# EAGLE design stepstick (EAGLE 5.11)
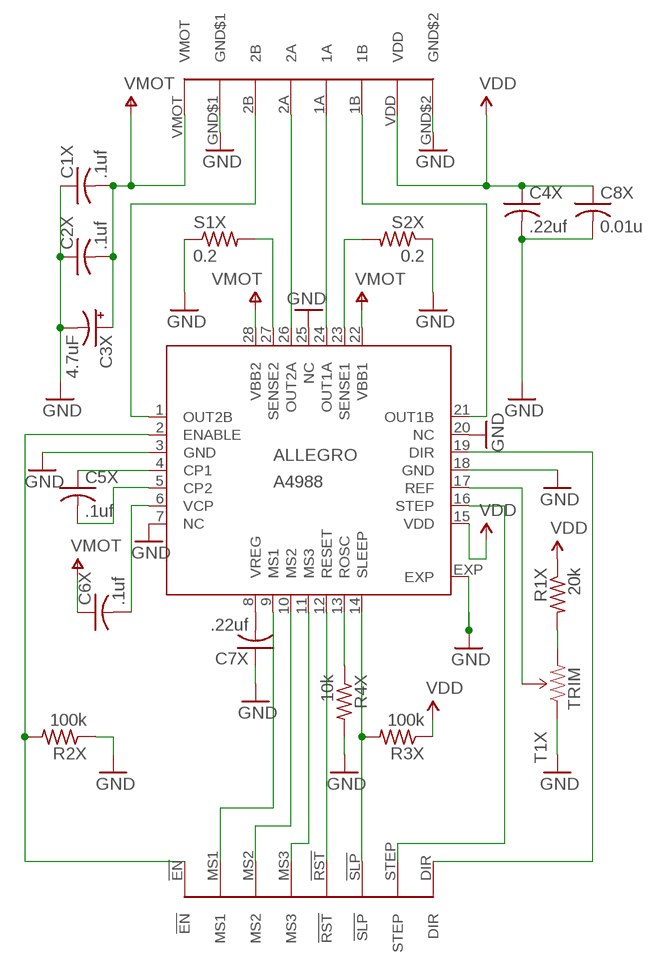
[diagram p0: schematic, sheet 1]

## Parts
ALLEGRO  A4988  A4983  [QFN28ET]
C1X  .1uf  C-USC0402  [C0402]
C2X  .1uf  C-USC0402  [C0402]
C3X  4.7uF  CPOL-USCT3216  [CT3216]
C4X  .22uf  C-USC0603  [C0603]
C5X  .1uf  C-USC0402  [C0402]
C6X  .1uf  C-USC0402  [C0402]
C7X  .22uf  C-USC0402  [C0402]
C8X  0.01u  C-USC0402  [C0402]
J1X  CLONOLU  [CLONOLU]
R1X  20k  R-US_R0402  [R0402]
R2X  100k  R-US_R0402  [R0402]
R3X  100k  R-US_R0402  [R0402]
R4X  10k  R-US_R0402  [R0402]
S1X  0.2  R-US_R0805  [R0805]
S2X  0.2  R-US_R0805  [R0805]
T1X  TRIM  TRIMPOTSMD  [TRIMPOT-3MM]

## Nets
GND: ALLEGRO.3(GND) ALLEGRO.7(NC) ALLEGRO.18(GND) ALLEGRO.20(NC) ALLEGRO.25(NC) ALLEGRO.EXP C1X.1 C2X.1 C3X.- C4X.2 C7X.1 C8X.2 J1X.GND$1(A4983$2:GND$1) J1X.GND$2(A4983$2:GND$2) R2X.1 R4X.2 S1X.1 S2X.1 T1X.1(CCW)
VDD: ALLEGRO.15(VDD) C4X.1 C8X.1 J1X.VDD(A4983$2:VDD) R1X.1 R3X.1
VMOT: ALLEGRO.22(VBB1) ALLEGRO.28(VBB2) C1X.2 C2X.2 C3X.+ C6X.1 J1X.VMOT(A4983$2:VMOT)
XCP1: ALLEGRO.4(CP1) C5X.1
XCP2: ALLEGRO.5(CP2) C5X.2
XDIR: ALLEGRO.19(DIR) J1X.DIR(A4983$1:DIR)
XENABLE: ALLEGRO.2(ENABLE) J1X.!EN(A4983$1:!EN) R2X.2
XMS1: ALLEGRO.9(MS1) J1X.MS1(A4983$1:MS1)
XMS2: ALLEGRO.10(MS2) J1X.MS2(A4983$1:MS2)
XMS3: ALLEGRO.11(MS3) J1X.MS3(A4983$1:MS3)
XOUT1A: ALLEGRO.24(OUT1A) J1X.1A(A4983$2:1A)
XOUT1B: ALLEGRO.21(OUT1B) J1X.1B(A4983$2:1B)
XOUT2A: ALLEGRO.26(OUT2A) J1X.2A(A4983$2:2A)
XOUT2B: ALLEGRO.1(OUT2B) J1X.2B(A4983$2:2B)
XREF: ALLEGRO.17(REF) T1X.2(WIPER)
XREF2: R1X.2 T1X.3(CW)
XRESET: ALLEGRO.12(RESET) J1X.!RST(A4983$1:!RST)
XROSC: ALLEGRO.13(ROSC) R4X.1
XSENSE1: ALLEGRO.23(SENSE1) S2X.2
XSENSE2: ALLEGRO.27(SENSE2) S1X.2
XSLEEP: ALLEGRO.14(SLEEP) J1X.!SLP(A4983$1:!SLP) R3X.2
XSTEP: ALLEGRO.16(STEP) J1X.STEP(A4983$1:STEP)
XVCP: ALLEGRO.6(VCP) C6X.2
XVREG: ALLEGRO.8(VREG) C7X.2

## Library data of the parts
ALLEGRO = allegro:A4983: DMOS Microstepping Driver with Translator Auto generated by make-symbol-device-package-bsdl.ulp Rev. 32 Source: http://www.allegromicro.com/en/Products/Part_Numbers/4983/4983.pdf; MPN: A4983SETTR-T; OC_FARNELL: 1688956; OC_NEWARK: 39M6763
C1X C2X C4X C5X C6X C7X C8X = LL:C-US: CAPACITOR, American symbol
C3X = LL:CPOL-US: POLARIZED CAPACITOR, American symbol Footprints somewhat modified from Adafruits (1206)
J1X = pololu-allegro:CLONOLU
R1X R2X R3X R4X S1X S2X = LL:R-US_: RESISTOR, American symbol
T1X = SparkFun:TRIMPOT

## Board
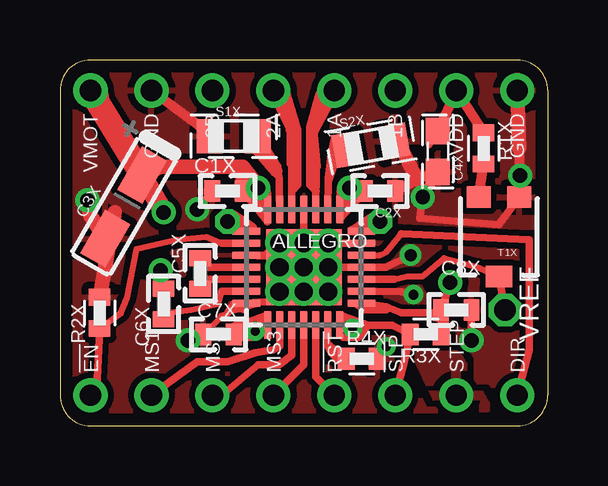
[diagram p1: board, top side]
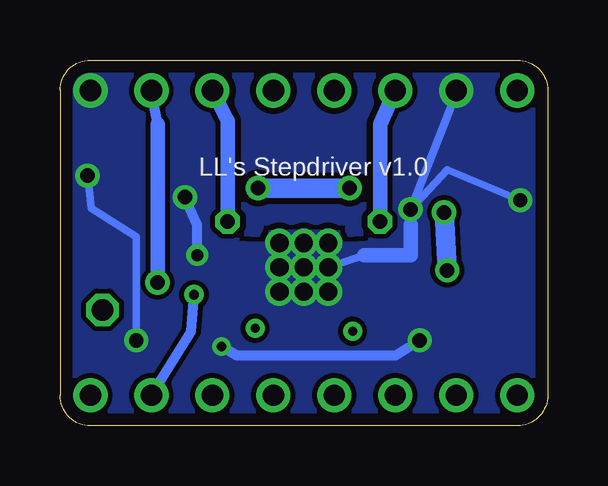
[diagram p2: board, bottom side, seen from below]

Size 20.32 x 15.24 mm. Coordinates in mm from the lower left corner, seen from the top.
Outline: 1.27,15.24 arc90 0,13.97 0,1.27 arc90 1.27,0 19.05,0 arc90 20.32,1.27 20.32,13.97 arc90 19.05,15.24 1.27,15.24
Copper layers (1*16): Top 0.0356mm / dielectric 1.5011mm / Bottom 0.0356mm
Design rules "LaenPCBOrder-LL-strict": minimum track width 8mil, minimum drill 16mil, track to track 8mil, track to pad 8mil, pad to pad 12mil, via to via 10mil, smd to smd 4mil, copper to edge 20mil, drill to drill 15mil, minimum pad ring 8mil, minimum via ring 8mil, stop-mask expansion 6mil, vias tented up to drill 25mil, thermal gap 12mil

### Footprints (pad centres in the part's own frame; a part is rotated, then mirrored left to right if it is on the bottom)
QFN28ET = smd 1.15 x 0.3: 1 -2.4,1.5; 2 -2.4,1; 3 -2.4,0.5; 4 -2.4,0; 5 -2.4,-0.5; 6 -2.4,-1; 7 -2.4,-1.5; 15 2.4,-1.5; 16 2.4,-1; 17 2.4,-0.5; 18 2.4,0; 19 2.4,0.5; 20 2.4,1; 21 2.4,1.5 | smd 0.3 x 1.15: 8 -1.5,-2.4; 9 -1,-2.4; 10 -0.5,-2.4; 11 0,-2.4; 12 0.5,-2.4; 13 1,-2.4; 14 1.5,-2.4; 22 1.5,2.4; 23 1,2.4; 24 0.5,2.4; 25 0,2.4; 26 -0.5,2.4; 27 -1,2.4; 28 -1.5,2.4 | smd 3.15 x 3.15: EXP 0,0
C0402 = smd 0.66 x 0.9: 1 -0.635,0; 2 0.635,0
CT3216 = smd 2.083 x 1.2: + 1.502,0; - -1.552,0
C0603 = smd 1.1 x 1: 1 -0.85,0; 2 0.85,0
CLONOLU = drill 0.889 pad 1.422 round: 1A 6.35,-1.27; 1B 6.35,-3.81; 2A 6.35,1.27; 2B 6.35,3.81; !EN -6.35,8.89; !RST -6.35,-1.27; !SLP -6.35,-3.81; DIR -6.35,-8.89; GND$1 6.35,6.35; GND$2 6.35,-8.89; MS1 -6.35,6.35; MS2 -6.35,3.81; MS3 -6.35,1.27; STEP -6.35,-6.35; VDD 6.35,-6.35; VMOT 6.35,8.89
R0402 = smd 0.7 x 0.9: 1 -0.65,0; 2 0.65,0
R0805 = smd 1.1 x 1.4: 1 -1,0; 2 1,0
TRIMPOT-3MM = smd 1 x 0.9: 1 -0.85,-1.65; 3 0.85,-1.65 | smd 1.1 x 0.9: 2 0,1.65

### Placement (x,y rotation side)
ALLEGRO  10.16,6.6 0 top
C1X  6.99,9.78 0 top
C2X  13.34,9.78 180 top
C3X  2.67,9.14 60 top
C4X  15.75,11.43 270 top
C5X  5.84,6.35 270 top
C6X  4.32,5.08 270 top
C7X  6.6,3.81 0 top
C8X  16.51,4.83 0 top
J1X  10.16,7.62 90 top
R1X  17.65,11.56 270 top
R2X  1.65,4.7 270 top
R3X  15.24,3.81 180 top
R4X  12.57,2.79 0 top
S1X  7.24,12.06 0 top
S2X  12.95,11.68 190 top
T1X  18.29,7.87 180 top

### Tracks (layer width: path | path; a pad name or v marks a point on that pad's centre or on a via)
GND  (via drill 0.38, 0.5, 0.6, 0.76)
  Top 0.254: v9.14,6.6 arc90 8.52,7.1 | ALLEGRO.7 6.73,4.57 C7X.1 | 7.24,4.83 7.63,4.83 ALLEGRO.7 | 7.24,5.08 7.63,5.08 ALLEGRO.7
  Top 0.305: v10.16,7.62 ALLEGRO.25 ALLEGRO.EXP | ALLEGRO.20 11.3,7.6 v11.18,7.62 | ALLEGRO.7 9.14,5.21 v10.16,5.59 v9.14,5.59 | v17.14,3.56 C8X.2 | T1X.1 18.29,8.38 14.99,8.64 v15.11,9.53 | ALLEGRO.18 v11.18,6.6 11.3,7.11 | ALLEGRO.18 13.59,6.6 v14.61,7.11 | v9.14,6.6 ALLEGRO.EXP | v9.14,7.62 8.52,7.1 ALLEGRO.3 10.41,6.99 | ALLEGRO.EXP 10.92,5.97 v11.18,5.59 | ALLEGRO.18 12.57,6.6 | 7.24,4.83 8.13,5.08 | 7.24,5.08 6.99,4.7 | v5.71,9.02 C1X.1
  Top 0.406: 19.13,11.56 v19.17,10.42 19.18,10.29 T1X.1 | v15.11,9.53 C4X.2 14.89,10.26 C2X.1 | v13.59,3.3 R4X.2 | C7X.1 v5.33,3.56 | 10.92,5.97 v11.18,6.6 v10.16,5.59 | 11.3,7.11 v11.18,7.62 | S1X.1 5.71,12.57 J1X.GND$1
  Top 0.61: 19.13,11.56 J1X.GND$2 | S2X.1 14.22,11.56 14.89,10.26 | R2X.1 2.29,8.89 C3X.- 1.27,8.76 v1.14,9.4
  Bottom 0.305: v17.14,3.56 17.14,7.87 19.01,9.07 v19.17,10.42 | 7.63,7.1 v9.14,6.6 | v5.71,9.02 5.71,8.38 | v5.71,9.02 4.06,13.21 J1X.GND$1 | v5.71,9.02 4.19,10.67 v1.14,9.4
  Bottom 0.406: v15.11,9.53 14.61,8.38 v14.61,7.11 | v13.59,3.3 12.95,2.92 6.35,2.92 v5.33,3.56
  Bottom 0.61: 7.63,7.1 5.71,7.11 5.71,8.38
  other vias: 10.16,6.6
  pour Top (isolate 0.254, rank 6): 0,15.24 20.07,15.24 20.07,0.25 0.13,0.13
  pour Bottom (rank 6, no thermals): 0,15.24 20.07,15.11 20.19,0.13 0.13,0.13
N$3
  pour Bottom (isolate 0.254, no thermals): 5.71,14.99 5.59,13.46 6.6,12.7 6.6,8.13 8.38,8 8.26,8.51 11.94,8.51 12.06,8 13.72,8.13 13.84,8.64 13.72,12.7 14.73,13.59 14.61,15.11
VDD  (via drill 0.6)
  Top 0.254: C4X.1 15.38,11.68 | 15.37,4.7 C8X.1 | 13.59,4.95 13.59,4.83
  Top 0.305: ALLEGRO.15 13.59,4.95 14.22,4.7 15.37,4.7 16,4.32 | C8X.1 v16.26,5.97 | 12.32,5.08 12.7,4.83 13.59,4.83
  Top 0.406: C4X.1 J1X.VDD R1X.1 | 16,4.32 R3X.1
  Bottom 0.406: 16.26,12.57 J1X.VDD
  Bottom 0.61: v16.26,5.97 16.26,12.57
VMOT  (via drill 0.6, 0.6 pad 1.02)
  Top 0.305: C1X.2 8.64,8.51 ALLEGRO.28 8,9.65 v8.26,9.91 | C2X.2 11.68,8.64 ALLEGRO.22 12.19,9.65 11.68,9.53 11.68,9.91 v12.06,9.91 | C6X.1 v4.19,6.48
  Top 0.406: 7.62,10.29 C1X.2
  Top 0.61: 7.62,10.29 8.51,9.65 7.62,10.79 4.19,10.79 C3X.+
  Top 0.813: v4.32,8.89 C3X.+
  Top 1.016: 1.52,13.72 J1X.VMOT C3X.+
  Bottom 0.813: v8.26,9.91 v12.06,9.91 | v4.19,6.48 v4.32,8.89
XCP1
  Top 0.254: C5X.1 6.11,6.6
  Top 0.305: 6.11,6.6 ALLEGRO.4
XCP2
  Top 0.254: 6.73,6.1 6.74,6.1 | C5X.2 6.11,6.1
  Top 0.305: 6.74,6.1 ALLEGRO.5 | 6.11,6.1 6.73,6.1
XDIR
  Top 0.254: 14.22,8 13.59,7.24 13.34,7.11 ALLEGRO.19
  Top 0.305: J1X.DIR 19.56,3.17 19.56,7.75 14.22,8
XENABLE
  Top 0.254: J1X.!EN 1.52,1.52 | 6.75,7.6 6.1,7.87 4.83,7.75 3.19,7.37 2.79,5.33 2.54,4.68 R2X.2
  Top 0.305: 1.52,1.52 R2X.2 | 6.75,7.6 ALLEGRO.2
XMS1
  Top 0.305: ALLEGRO.9 9.16,3.32 8.89,3.17 8.13,3.05 6.99,2.67 5.71,2.67 J1X.MS1
XMS2
  Top 0.254: J1X.MS2 6.73,1.27
  Top 0.305: 6.73,1.27 8.26,2.54 9.14,2.54 9.66,2.93 ALLEGRO.10
XMS3
  Top 0.305: J1X.MS3 10.16,2.54 ALLEGRO.11
XOUT1A
  Top 0.305: ALLEGRO.24 10.67,10.79 | 10.41,12.32 10.41,10.03 10.67,9.78 | 10.54,12.32 10.41,12.32 | 10.92,14.22 10.79,13.34 10.79,13.84 10.41,12.45 10.41,12.32
  Top 0.406: 10.67,10.79 10.54,12.32
  Top 0.508: 10.54,12.32 J1X.1A
XOUT1B  (via drill 0.6 pad 1.02)
  Top 0.254: 12.19,8.13 12.56,8.13 ALLEGRO.21
  Top 0.305: ALLEGRO.21 v13.34,8.51
  Top 0.406: 12.19,8.13 12.95,8.64
  Bottom 0.61: v13.34,8.51 13.34,12.7 J1X.1B
XOUT2A
  Top 0.305: ALLEGRO.26 9.65,10.92 | 9.91,12.32 9.91,10.03 9.65,9.78 | 9.91,12.32 9.55,12.32 9.55,12.65 | 9.91,12.32 9.4,13.97
  Top 0.406: 9.65,10.92 9.65,12.45
  Top 0.508: 9.65,12.45 9.55,12.65 J1X.2A
XOUT2B  (via drill 0.6 pad 1.02)
  Top 0.254: 8,8.26 7.76,8.26 ALLEGRO.1
  Top 0.305: v6.99,8.51 ALLEGRO.1
  Top 0.406: 8,8.26 7.24,8.76
  Bottom 0.61: v6.99,8.51 6.99,12.57 J1X.2B
XREF  (via drill 0.9 pad 0.41)
  Top 0.254: 13.93,6.1 14.48,6.22 15.11,6.22 16,6.99 17.4,6.6 T1X.2
  Top 0.305: ALLEGRO.17 13.93,6.1 | T1X.2 v18.54,4.83
XREF2
  Top 0.406: T1X.3 R1X.2
XRESET
  Top 0.305: J1X.!RST 10.66,2.04 ALLEGRO.12
XROSC
  Top 0.254: 11.16,3.32 ALLEGRO.13 | 11.3,3.05 11.16,3.43 R4X.1
  Top 0.305: 11.16,3.32 11.3,3.05 11.68,2.67
XSENSE1
  Top 0.305: 11.43,10.92 11.18,10.16 11.43,11.94 11.3,11.3 11.18,10.29 ALLEGRO.23
  Top 0.406: 11.43,10.92 S2X.2
XSENSE2
  Top 0.305: 9.02,10.79 9.05,10.68 9.14,10.29 9.14,9.65 ALLEGRO.27
  Top 0.406: 9.02,10.79 S1X.2 | 8.13,11.56 9.02,10.54 9.05,10.54 9.05,10.68
XSLEEP  (via drill 0.38 pad 0.25)
  Top 0.254: v12.19,4.06 11.79,4.06 ALLEGRO.14 | 12.83,4.19 12.7,4.19
  Top 0.305: J1X.!SLP 14.35,2.67 R3X.2 13.84,4.19 12.83,4.19 | 12.83,4.19 11.81,4.57 ALLEGRO.14 | 12.83,4.19 12.45,3.68 11.81,3.68
XSTEP  (via drill 0.41)
  Top 0.305: v14.73,5.46 14.22,5.59 ALLEGRO.16
  Bottom 0.406: J1X.STEP 14.86,3.94 v14.73,5.46
  pour Top: 13.59,5.59 15.88,0.76 17.78,0.76 14.86,5.84 13.72,5.59
XVCP
  Top 0.254: 6.75,5.6 6.6,5.08 5.46,4.83 4.46,4.7 C6X.2
  Top 0.305: 6.75,5.6 ALLEGRO.6
XVREG  (via drill 0.38 pad 0.25)
  Top 0.254: 7.62,4.19 7.25,4.19 C7X.2 | 7.82,4.31 7.82,3.94
  Top 0.305: ALLEGRO.8 8.38,4.2 8.51,4.57 7.82,4.31 7.38,4.2 C7X.2 | 7.62,4.19 7.62,3.68
  Top 0.813: 7.82,3.94 v8.13,3.94

### Text on the board
_tsilk: VREF
_bsilk: LL's Stepdriver v1.0